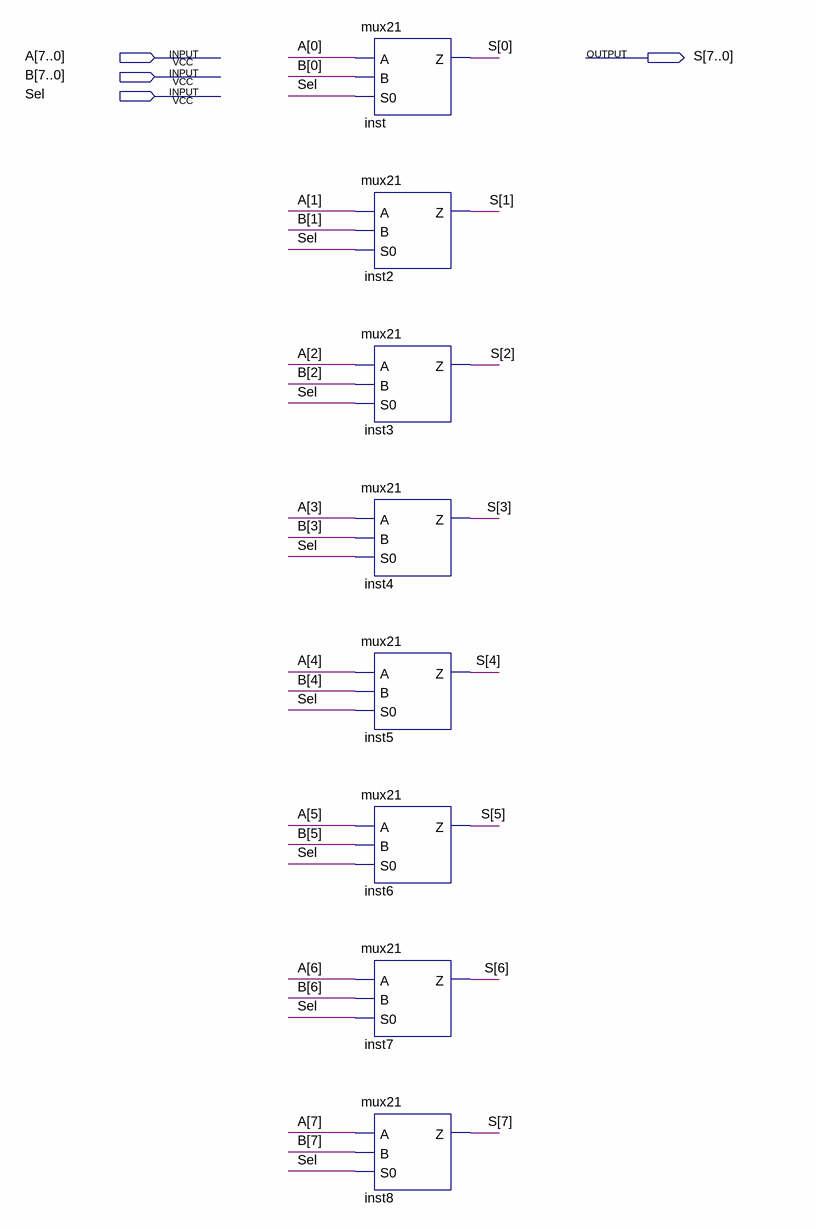
[diagram p0: schematic sheet]
// Quartus schematic mux8bits21.bdf as structural Verilog: 8 symbols, 4 pins
module mux8bits21 (
  input  [7:0] A,
  input  [7:0] B,
  input  Sel,
  output [7:0] S
);

  mux21 inst (.A(A[0]), .B(B[0]), .S0(Sel), .Z(S[0]));
  mux21 inst2 (.A(A[1]), .B(B[1]), .S0(Sel), .Z(S[1]));
  mux21 inst3 (.A(A[2]), .B(B[2]), .S0(Sel), .Z(S[2]));
  mux21 inst4 (.A(A[3]), .B(B[3]), .S0(Sel), .Z(S[3]));
  mux21 inst5 (.A(A[4]), .B(B[4]), .S0(Sel), .Z(S[4]));
  mux21 inst6 (.A(A[5]), .B(B[5]), .S0(Sel), .Z(S[5]));
  mux21 inst7 (.A(A[6]), .B(B[6]), .S0(Sel), .Z(S[6]));
  mux21 inst8 (.A(A[7]), .B(B[7]), .S0(Sel), .Z(S[7]));
endmodule
